# Altium schematic sheet Wein.SchDoc
size A4
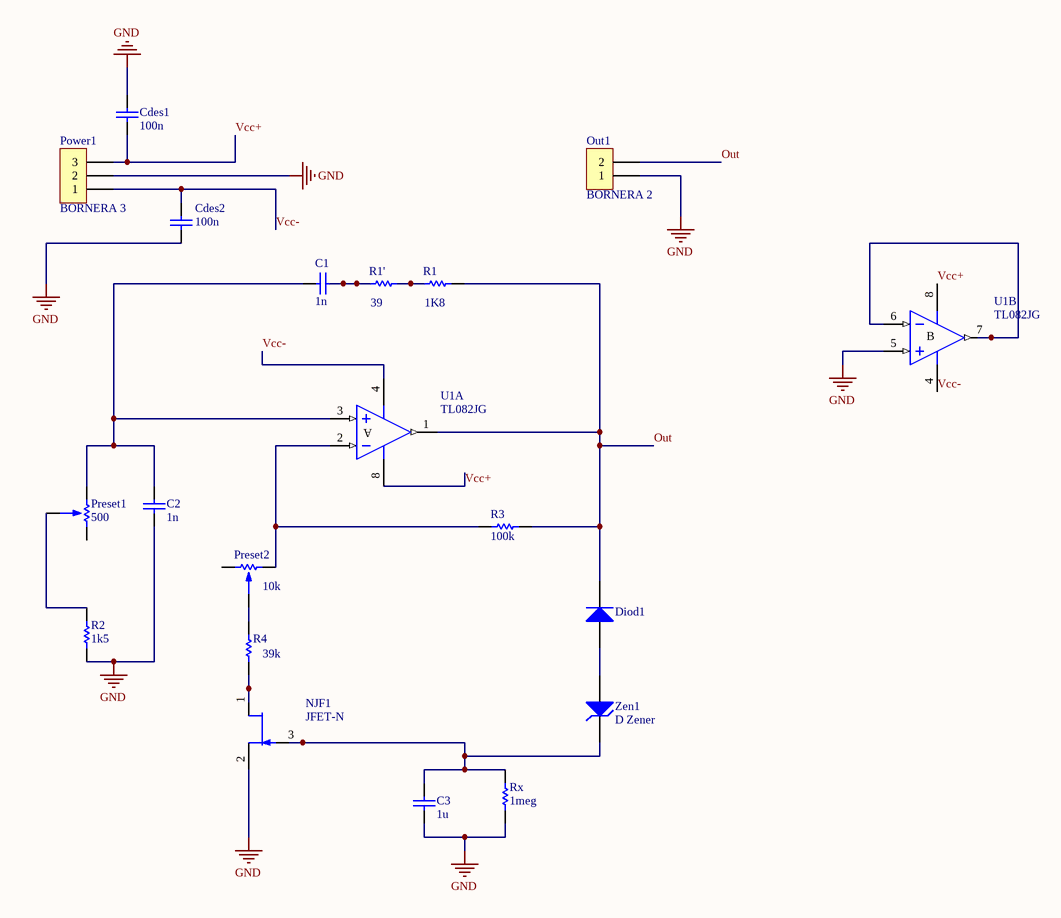
[diagram p0: Wein.SchDoc]

## Parts
C1  1n  [RAD-0.3]
C2  1n  [RAD-0.3]
C3  1u  [RAD-0.3]
Cdes1  100n  [RAD-0.3]
Cdes2  100n  [RAD-0.3]
Diod1  (no value)  [DO-35]
NJF1  JFET-N  [TO-254-AA]
Out1  BORNERA 2  [BORNERA2]
Power1  BORNERA 3  [BORNERA3]
Preset1  500  [PRESET V]
Preset2  10k  [PRESET V]
R1  1K8  [AXIAL-0.3]
R1'  39  [AXIAL-0.3]
R2  1k5  [AXIAL-0.3]
R3  100k  [AXIAL-0.3]
R4  39k  [AXIAL-0.3]
Rx  1meg  [AXIAL-0.3]
U1  TL082JG  [JG008]  (parts A,B of 2)
Zen1  D Zener  [DIODE-0.7]

## Nets
GND: C2.1 C3.1 Cdes1.2 Cdes2.1 NJF1.2(S) Out1.1 Power1.2 R2.1 Rx.1 U1.5(IN+)
Out: Diod1.2(K) Out1.2 R1.2 R3.2 U1.1(OUT)
Vcc+: Cdes1.1 Power1.3 U1.8(V+)
Vcc-: Cdes2.2 Power1.1 U1.4(V-)
NetC1_1: C1.1 C2.2 Preset1.3 U1.3(IN+)
NetC1_2: C1.2 R1'.1
NetC3_2: C3.2 NJF1.3(G) Rx.2 Zen1.2(K)
NetDiod1_1: Diod1.1(A) Zen1.1(A)
NetNJF1_1: NJF1.1(D) R4.2
NetPreset1_2: Preset1.2 R2.2
NetPreset2_1: Preset2.1 R3.1 U1.2(IN-)
NetPreset2_2: Preset2.2 R4.1
NetR1_1: R1.1 R1'.2
NetU1_6: U1.6(IN-) U1.7(OUT)

Not connected (* = marked no-connect by the designer): Preset1 1; Preset2 3

## Notes on the sheet
- (in symbol TL082JG, part A) A
- (in symbol TL082JG, part B) B

## Library data of the parts
C1-C3 Cdes1 Cdes2 = Cap: Capacitor; Published: 8-Jun-2000; LatestRevisionDate: 17-Jul-2002; LatestRevisionNote: Re-released for DXP Platform.; PackageReference: RAD-0.3; Publisher: Altium Limited; PackageDescription: Radial Cap, Thru-Hole; 2 Leads; 0.3 in Pin Spacing
Diod1 = Diode 1N4148: High Conductance Fast Diode; Published: 8-Jun-2000; LatestRevisionDate: 17-Jul-2002; LatestRevisionNote: Re-released for DXP Platform.; DatasheetVersion: 1997; PackageReference: DO-35; Publisher: Altium Limited; PackageDescription: Diode, Axial; Body 3.8 x 1.9 mm (LxDia. max), Lead Dia. 0.53 mm (max); Code_JEDEC: DO-204-AH; ComponentLink1Description: Manufacturer Link; ComponentLink1URL: http://www.fairchildsemi.com/; ComponentLink2Description: Datasheet; ComponentLink2URL: http://www.fairchildsemi.com/ds/1N%2F1N4148.pdf
NJF1 = JFET-N: N-Channel JFET; Published: 8-Jun-2000; LatestRevisionDate: 17-Jul-2002; LatestRevisionNote: Re-released for DXP Platform.; PackageReference: TO-254-AA; Publisher: Altium Limited; Code_JEDEC: TO-254-AA
Preset1 Preset2 = PRESET
R1 R1' R2-R4 Rx = Res1: Resistor; Published: 8-Jun-2000; LatestRevisionDate: 17-Jul-2002; LatestRevisionNote: Re-released for DXP Platform.; PackageReference: AXIAL-0.3; Publisher: Altium Limited; PackageDescription: Axial Device, Thru-Hole; 2 Leads; 0.3 in Pin Spacing
U1 = TL082JG: JFET-Input Operational Amplifier; Published: 16-Jan-2001; LatestRevisionDate: 04-Mar-2005; LatestRevisionNote: Stylized 3D Model Added.; DatasheetVersion: Feb-1999; PackageVersion: Jan-1995; PackageReference: JG008; Publisher: Altium Limited; PackageDescription: DIP; 8 Leads; Row Spacing 7.62 mm; Pitch 2.54 mm; ComponentLink1Description: Manufacturer Link; ComponentLink1URL: http://www.ti.com/; ComponentLink2Description: Datasheet; ComponentLink2URL: http://www-s.ti.com/sc/ds/tl082.pdf
Zen1 = D Zener: Zener Diode; Published: 8-Jun-2000; LatestRevisionDate: 17-Jul-2002; LatestRevisionNote: Re-released for DXP Platform.; PackageReference: DIODE-0.7; Publisher: Altium Limited; PackageDescription: Diode, Thru-Hole; 2 Leads; 0.7 in Pin Spacing